# Altium project eSolderControl_v3.PrjPcb
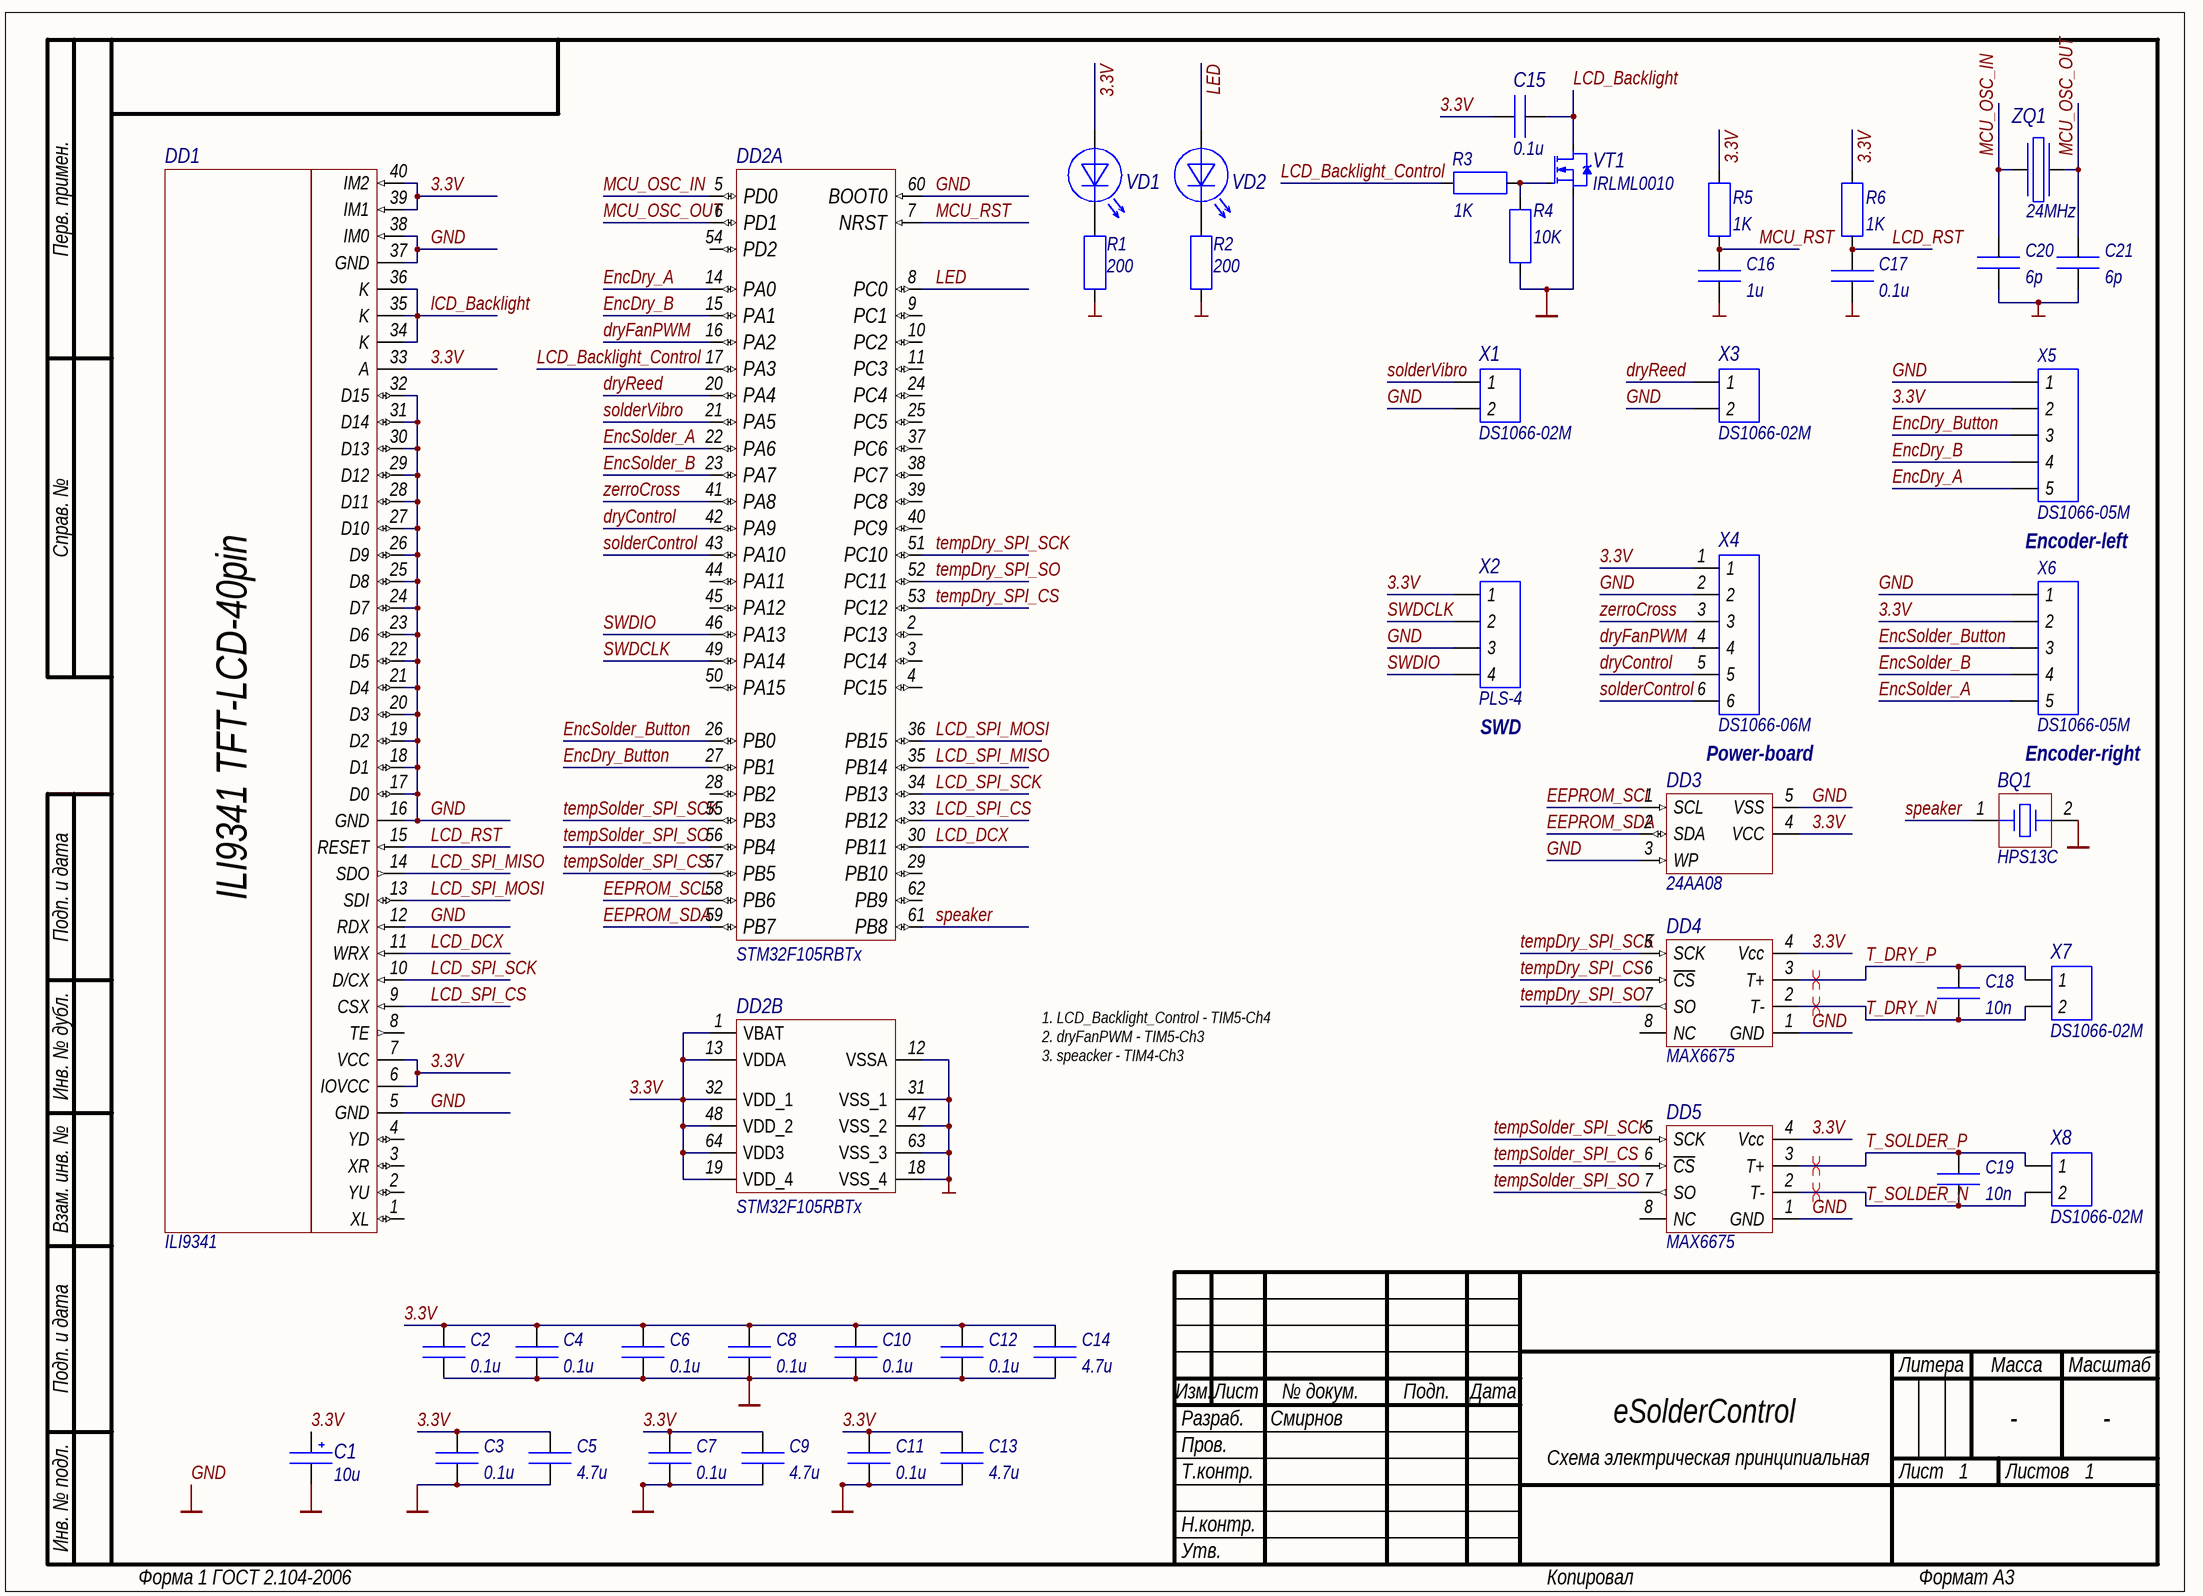
[diagram p0: eSolderControl_v3.SchDoc]
GlobalProjectName: eSolderControl; GlobalProjectRevision: 3
1 sheet, 45 parts. Net scope: global (net labels, ports and power ports of the same name join across sheets).
Board file: eSolderControl_v3.PcbDoc

## Sheet eSolderControl_v3.SchDoc: =GlobalProjectName
size 410 x 297 mm; Author: Смирнов; DocumentNumber: Э3; Revision: 3; SheetNumber: 1; SheetTotal: 1; PageSetup: Record=PageOptions|CenterHorizontal=True|CenterVertical=True|PrintScale=1.00|XCorrection=1.00|YCorrection=1.00|PrintKind=1|BorderSize=5000000|LeftOffset=0|BottomOffset=0|Orientation=2|PaperLength=1000|PaperWidth=1000|Scale=100|PaperSource=15|PrintQuality=1200|MediaType=1|DitherType=10|PaperKind=A3|PrintScaleMode=1; Weight: -; ScaleFactor: -; DocumentName: eSolderControl

### Parts
BQ1  HPS13C  [HPS13C]
C1  10u  [CAP_TYPE_A]
C2  0.1u  [C0402]
C3  0.1u  [C0402]
C4  0.1u  [C0402]
C5  4.7u  [C0603]
C6  0.1u  [C0402]
C7  0.1u  [C0402]
C8  0.1u  [C0402]
C9  4.7u  [C0603]
C10  0.1u  [C0402]
C11  0.1u  [C0402]
C12  0.1u  [C0402]
C13  4.7u  [C0603]
C14  4.7u  [C0603]
C15  0.1u  [C0402]
C16  1u  [C0603]
C17  0.1u  [C0402]
C18  10n  [C0402]
C19  10n  [C0402]
C20  6p  [C0603]
C21  6p  [C0603]
DD1  ILI9341  [ili9341-2.4'']
DD2  STM32F105RBTx  [LQFP64]  (parts A,B of 2)
DD3  24AA08  [SOT95P245X145-5N]
DD4  MAX6675  [SOIC127P600X175-8N]
DD5  MAX6675  [SOIC127P600X175-8N]
R1  200  [R0603]
R2  200  [R0603]
R3  1K  [R0603]
R4  10K  [R0603]
R5  1K  [R0603]
R6  1K  [R0603]
VD1  *  [LED 0603_Green]  (value not drawn)
VD2  *  [LED 0603_RED]  (value not drawn)
VT1  IRLML0010  [SOT23-3]
X1  DS1066-02M  [DS1066-02M]
X2  PLS-4  [PLS-4]
X3  DS1066-02M  [DS1066-02M]
X4  DS1066-06M  [DS1066-06M]
X5  DS1066-05M  [DS1066-05M]
X6  DS1066-05M  [DS1066-05M]
X7  DS1066-02M  [DS1066-02M]
X8  DS1066-02M  [DS1066-02M]
ZQ1  24MHz  [XRCGB_F_Z]

### Nets
GND: BQ1.2 C1.2 C2.1 C3.1 C4.1 C5.1 C6.2 C7.1 C8.1 C9.1 C10.1 C11.1 C12.1 C13.1 C14.1 C16.2 C17.2 C20.1 C21.1 DD1.5(GND) DD1.12(RDX) DD1.16(GND) DD1.17(D0) DD1.18(D1) DD1.19(D2) DD1.20(D3) DD1.21(D4) DD1.22(D5) DD1.23(D6) DD1.24(D7) DD1.25(D8) DD1.26(D9) DD1.27(D10) DD1.28(D11) DD1.29(D12) DD1.30(D13) DD1.31(D14) DD1.32(D15) DD1.37(GND) DD1.38(IM0) DD2.12(VSSA) DD2.18(VSS_4) DD2.31(VSS_1) DD2.47(VSS_2) DD2.60(BOOT0) DD2.63(VSS_3) DD3.3(WP) DD3.5(VSS) DD4.1(GND) DD5.1(GND) R1.2 R2.2 R4.1 VT1.3(S) X1.2 X2.3 X3.2 X4.2 X5.1 X6.1
3.3V: C1.1 C2.2 C3.2 C4.2 C5.2 C6.1 C7.2 C8.2 C9.2 C10.2 C11.2 C12.2 C13.2 C14.2 C15.1 DD1.6(IOVCC) DD1.7(VCC) DD1.33(A) DD1.39(IM1) DD1.40(IM2) DD2.1(VBAT) DD2.13(VDDA) DD2.19(VDD_4) DD2.32(VDD_1) DD2.48(VDD_2) DD2.64(VDD3) DD3.4(VCC) DD4.4(Vcc) DD5.4(Vcc) R5.1 R6.1 VD1.1 X2.1 X4.1 X5.2 X6.2
dryControl: DD2.42(PA9) X4.5
dryFanPWM: DD2.16(PA2) X4.4
dryReed: DD2.20(PA4) X3.1
EEPROM_SCL: DD2.58(PB6) DD3.1(SCL)
EEPROM_SDA: DD2.59(PB7) DD3.2(SDA)
EncDry_A: DD2.14(PA0) X5.5
EncDry_B: DD2.15(PA1) X5.4
EncDry_Button: DD2.27(PB1) X5.3
EncSolder_A: DD2.22(PA6) X6.5
EncSolder_B: DD2.23(PA7) X6.4
EncSolder_Button: DD2.26(PB0) X6.3
LCD_Backlight: C15.2 DD1.34(K) DD1.35(K) DD1.36(K) VT1.2(D)
LCD_Backlight_Control: DD2.17(PA3) R3.1
LCD_DCX: DD1.11(WRX) DD2.30(PB11)
LCD_RST: C17.1 DD1.15(RESET) R6.2
LCD_SPI_CS: DD1.9(CSX) DD2.33(PB12)
LCD_SPI_MISO: DD1.14(SDO) DD2.35(PB14)
LCD_SPI_MOSI: DD1.13(SDI) DD2.36(PB15)
LCD_SPI_SCK: DD1.10(D/CX) DD2.34(PB13)
LED: DD2.8(PC0) VD2.1
MCU_OSC_IN: C20.2 DD2.5(PD0) ZQ1.1
MCU_OSC_OUT: C21.2 DD2.6(PD1) ZQ1.2
MCU_RST: C16.1 DD2.7(NRST) R5.2
solderControl: DD2.43(PA10) X4.6
solderVibro: DD2.21(PA5) X1.1
speaker: BQ1.1 DD2.61(PB8)
SWDCLK: DD2.49(PA14) X2.2
SWDIO: DD2.46(PA13) X2.4
T_DRY_N: C18.1 DD4.2(T-) X7.2
T_DRY_P: C18.2 DD4.3(T+) X7.1
T_SOLDER_N: C19.1 DD5.2(T-) X8.2
T_SOLDER_P: C19.2 DD5.3(T+) X8.1
tempDry_SPI_CS: DD2.53(PC12) DD4.6(~{CS})
tempDry_SPI_SCK: DD2.51(PC10) DD4.5(SCK)
tempDry_SPI_SO: DD2.52(PC11) DD4.7(SO)
tempSolder_SPI_CS: DD2.57(PB5) DD5.6(~{CS})
tempSolder_SPI_SCK: DD2.55(PB3) DD5.5(SCK)
tempSolder_SPI_SO: DD2.56(PB4) DD5.7(SO)
zerroCross: DD2.41(PA8) X4.3
NetR1_1: R1.1 VD1.2
NetR2_1: R2.1 VD2.2
NetR3_2: R3.2 R4.2 VT1.1(G)

Not connected (* = marked no-connect by the designer): DD1 1(XL) 2(YU) 3(XR) 4(YD) 8(TE); DD2 2(PC13) 3(PC14) 4(PC15) 9(PC1) 10(PC2) 11(PC3) 24(PC4) 25(PC5) 28(PB2) 29(PB10) 37(PC6) 38(PC7) 39(PC8) 40(PC9) 44(PA11) 45(PA12) 50(PA15) 54(PD2) 62(PB9); DD4 8(NC); DD5 8(NC)

### Layout directives
differential pair: T_DRY_N, T_DRY_P, T_SOLDER_N, T_SOLDER_P

### Notes on the sheet
- Encoder-left
- (near X2) SWD
- Power-board
- Encoder-right
- 1. LCD_Backlight_Control - TIM5-Ch4
  2. dryFanPWM - TIM5-Ch3
  3. speacker - TIM4-Ch3
- eSolderControl
- Перв. примен.
- Справ. №
- Подп. и дата
- Инв. № дубл.
- Взам. инв. №
- Разраб.
- Изм.
- Лист
- № докум.
- Подп.
- Дата
- Литера
- Масса
- Масштаб
- Пров.
- Т.контр.
- Схема электрическая принципиальная
- Листов
- Инв. № подл.
- Н.контр.
- Утв.
- Форма 1 ГОСТ 2.104-2006
- Копировал
- Формат А3
- (in symbol ili9341) ILI9341 TFT-LCD-40pin

### Library data of the parts
BQ1 = Buzzer: Name: HPS13C; Value: *
C1 = Capasitor(Pol): Name: TECAP 10/10V; Value: 10u
C2-C15 C18 C19 = Capasitor
  C2 C4: Value: 0.1u; Other: *
  C3 C6-C8 C10-C12: Value: 0.1u
  C5 C9 C13 C14: Value: 4.7u; Other: *
  C15: Value: 0.1u; Name: *
  C18 C19: Value: 10n; Other: *
C16 C17 = Capasitor: Other: Космодром
  C16: Value: 1u
  C17: Value: 0.1u
C20 C21 = Capasitor: Other: Алиэкспрес; Value: 6p
DD3 = 24AA08: 8K I2C Serial EEPROM; Name: 24AA08; Value: *
DD4 DD5 = MAX31855/6675: Name: MAX6675
R1-R6 = Resistor: Other: *
  R1 R2: Value: 200
  R3 R5 R6: Value: 1K
  R4: Value: 10K
VD1 = LED: Value: 0603 green; Name: *
VD2 = LED: Value: 0603red; Name: *
VT1 = N-channel MOSFET: pin to pad: 2>3 3>2; Name: IRLML0010
X1 X3 X7 X8 = 2-PIN: Other: *; Name: DS1066-02M
X2 = 4-PIN: Name: PLS-4; Value: *
X4 = 6-PIN: Name: DS1066-06M; Value: *
X5 X6 = 5-PIN: Name: DS1066-05M; Value: *
ZQ1 = Resonator: pin to pad: 2>3; Name: XRCGB_F_Z; Value: 24MHz
DD2 = STM32F105RBTx: Name: STM32F105RBTx